# EasyEDA Pro project ProPrj_智能车主板第二版_2025-03-14.epro

# Schematic Schematic1
Board Name: Board1; Create Date: 2025-02-16; Page Name: P1; Project Name: 智能车主板; Schematic Name: Schematic1; Update Date: 2025-03-13; Company: 嘉立创EDA; Page Size: A4; Version: V1.0
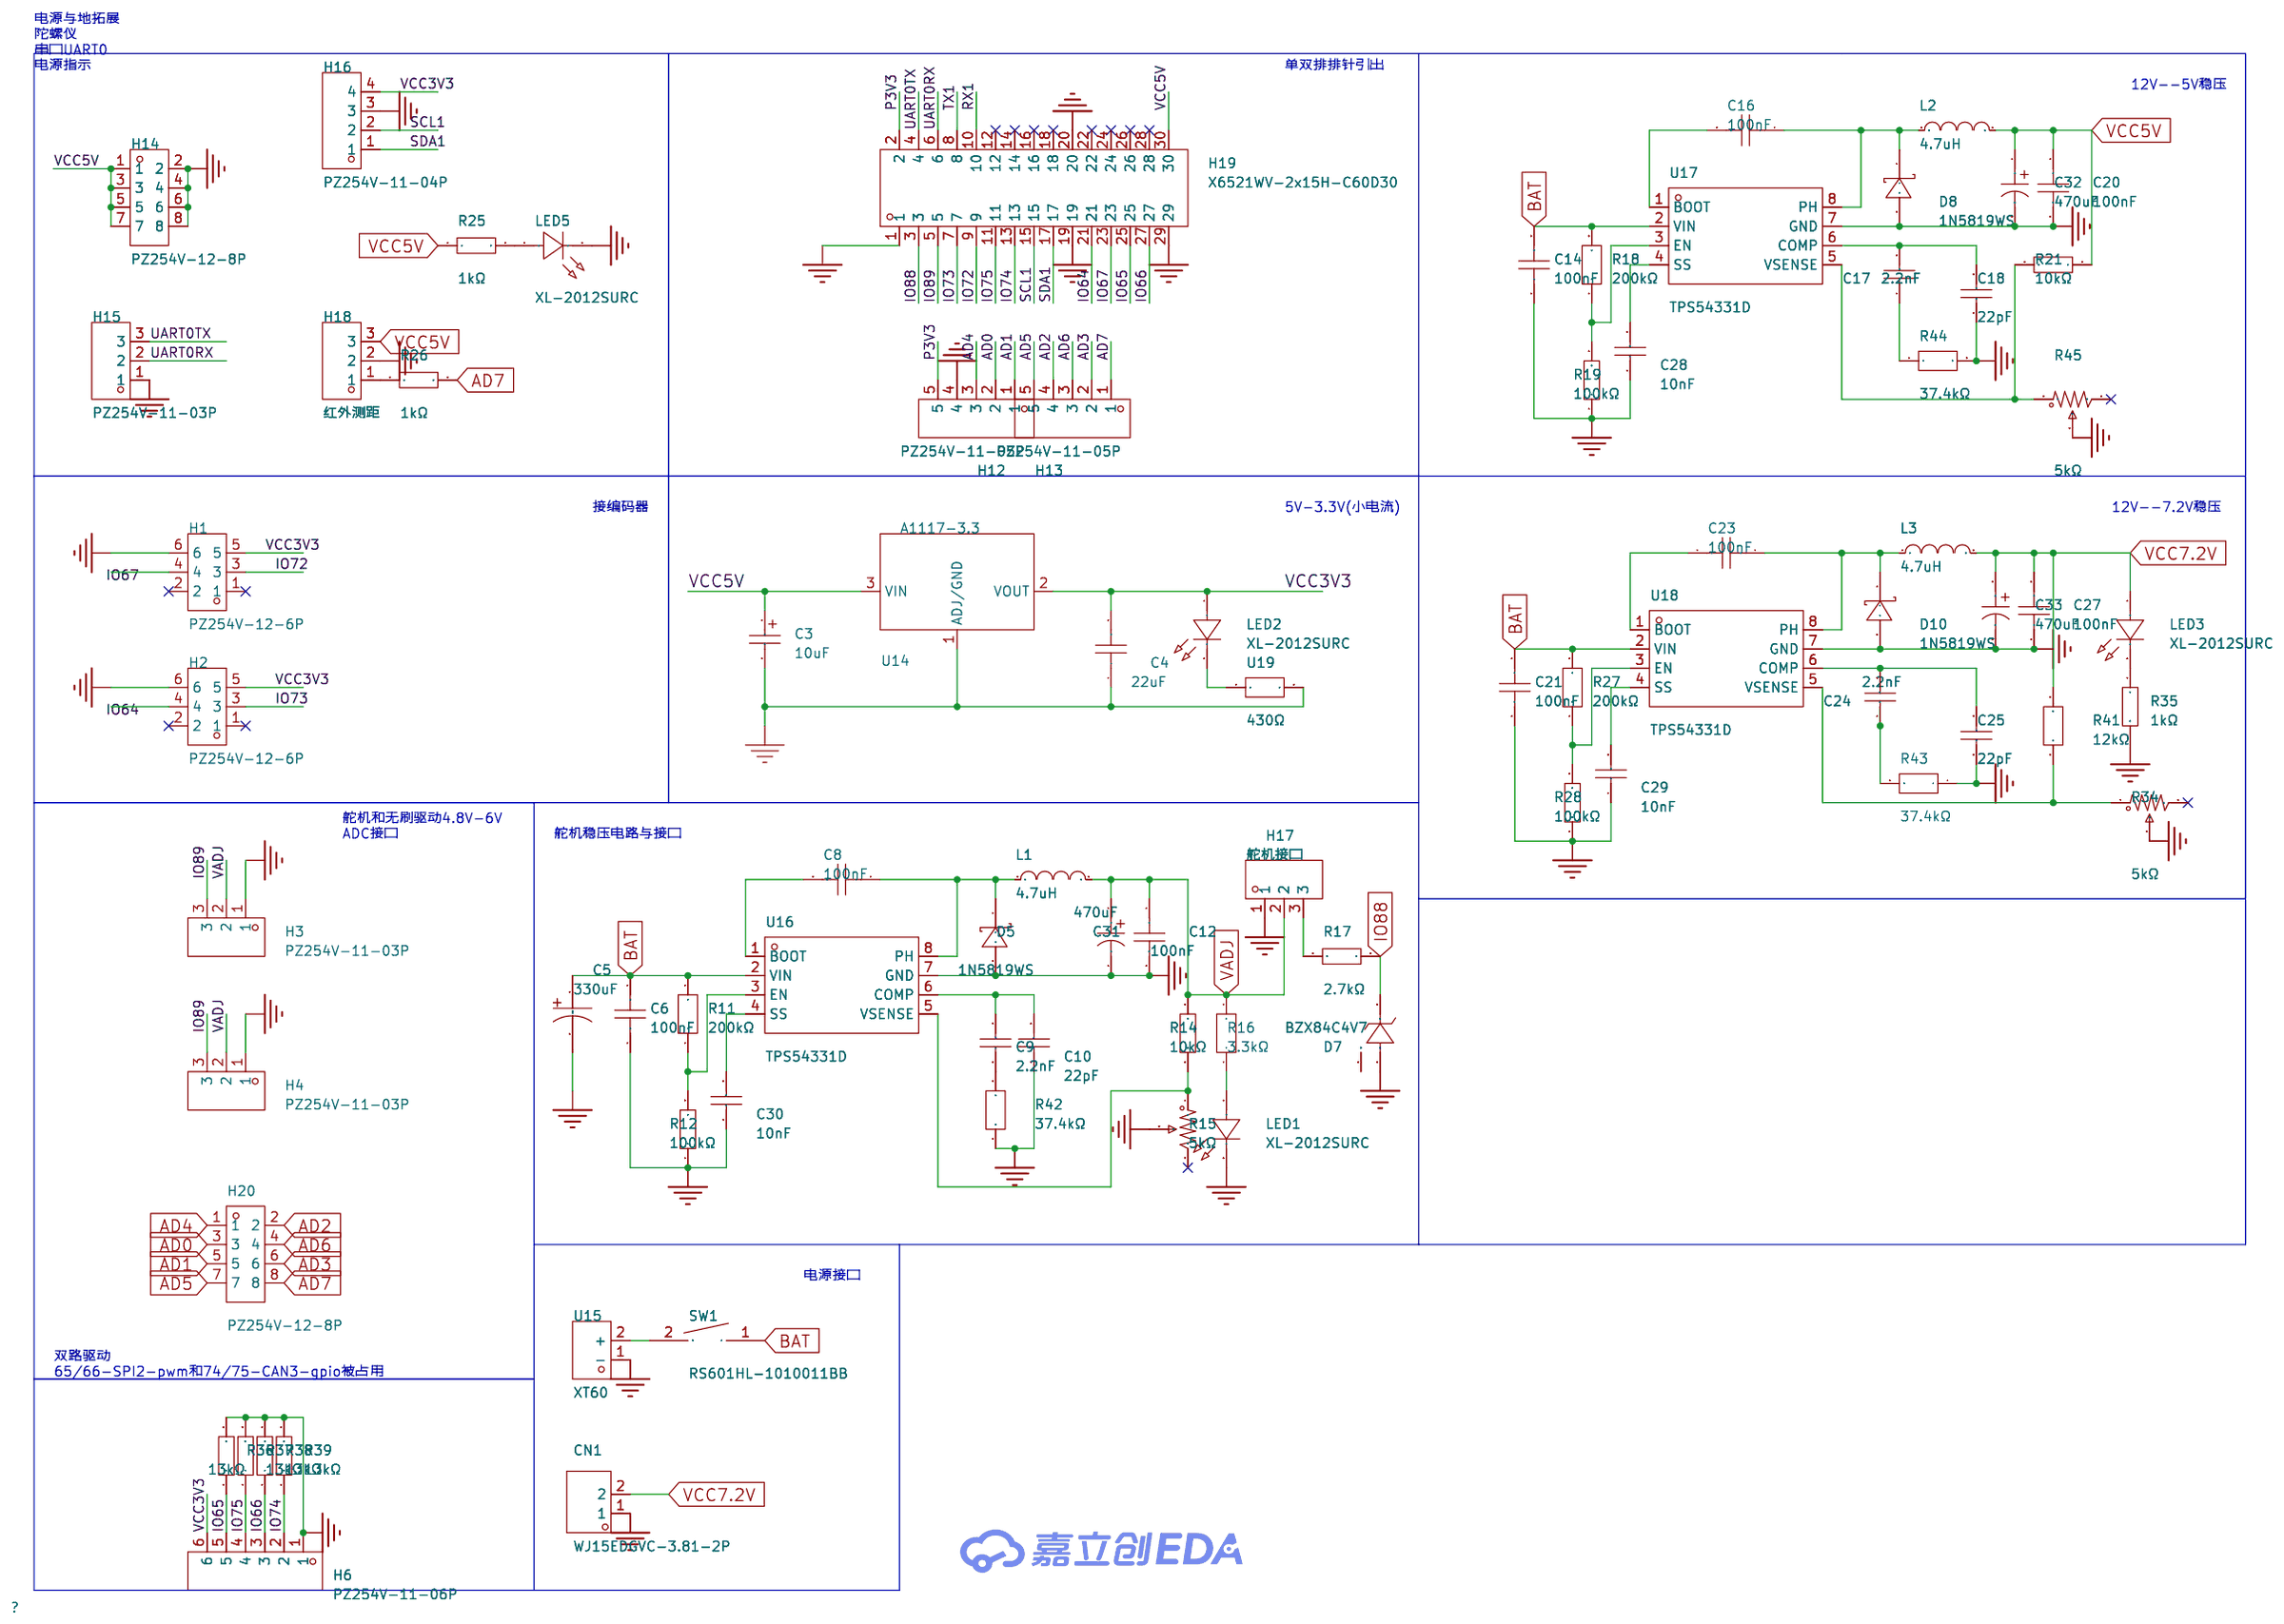
[diagram p0: schematic sheet]

## Parts
C3  10uF  [CAP-SMD_L6.0-W3.2]
C4  22uF  [C0805]
C5  330uF  [CAP-SMD_BD8.0-L8.3-W8.3-LS9.3-FD-1]
C6  100nF  [C0805]
C8  100nF  [C0805]
C9  2.2nF  [C0805]
C10  22pF  [C0603]
C12  100nF  [C0805]
C14  100nF  [C0805]
C16  100nF  [C0805]
C17  2.2nF  [C0805]
C18  22pF  [C0603]
C20  100nF  [C0805]
C21  100nF  [C0805]
C23  100nF  [C0805]
C24  2.2nF  [C0805]
C25  22pF  [C0603]
C27  100nF  [C0805]
C28  10nF  [C0805]
C29  10nF  [C0805]
C30  10nF  [C0805]
C31  470uF  [CAP-SMD_BD8.0-L8.3-W8.3-LS8.9-FD]
C32  470uF  [CAP-SMD_BD8.0-L8.3-W8.3-LS8.9-FD]
C33  470uF  [CAP-SMD_BD8.0-L8.3-W8.3-LS8.9-FD]
CN1  WJ15EDGVC-3.81-2P  [CONN-TH_WJ15EDGVC-3.81-2P]
D5  1N5819WS  [SOD-323_L1.8-W1.3-LS2.5-RD]
D7  BZX84C4V7  [SOT-23-3_L2.9-W1.3-P1.90-LS2.4-BR]
D8  1N5819WS  [SOD-323_L1.8-W1.3-LS2.5-RD]
D10  1N5819WS  [SOD-323_L1.8-W1.3-LS2.5-RD]
H1  PZ254V-12-6P  [HDR-TH_6P-P2.54-V-M-R2-C3-S2.54]
H2  PZ254V-12-6P  [HDR-TH_6P-P2.54-V-M-R2-C3-S2.54]
H3  PZ254V-11-03P  [HDR-TH_3P-P2.54-V-M]
H4  PZ254V-11-03P  [HDR-TH_3P-P2.54-V-M]
H6  PZ254V-11-06P  [HDR-TH_6P-P2.54-V-M]
H12  PZ254V-11-05P  [HDR-TH_5P-P2.54-V-M]
H13  PZ254V-11-05P  [HDR-TH_5P-P2.54-V-M]
H14  PZ254V-12-8P  [HDR-TH_8P-P2.54-V-M-R2-C4-S2.54]
H15  PZ254V-11-03P  [HDR-TH_3P-P2.54-V-M]
H16  PZ254V-11-04P  [HDR-TH_4P-P2.54-V-M]
H17  舵机接口  [HDR-TH_3P-P2.54-V-M]
H18  红外测距  [HDR-TH_3P-P2.54-V-M]
H19  X6521WV-2x15H-C60D30  [HDR-TH_30P-P2.54-V-M-R2-C15-S2.54-BL]
H20  PZ254V-12-8P  [HDR-TH_8P-P2.54-V-M-R2-C4-S2.54]
L1  4.7uH  [IND-SMD_L7.3-W6.6_MHCI06030]
L2  4.7uH  [IND-SMD_L7.3-W6.6_MHCI06030]
L3  4.7uH  [IND-SMD_L7.3-W6.6_MHCI06030]
LED1  XL-2012SURC  [LED0805-R-RD]
LED2  XL-2012SURC  [LED0805-R-RD]
LED3  XL-2012SURC  [LED0805-R-RD]
LED5  XL-2012SURC  [LED0805-R-RD]
R11  200kΩ  [R0603]
R12  100kΩ  [R0805]
R14  10kΩ  [R0805]
R15  5kΩ  [RES-ADJ-TH_3P-L6.8-W4.6-P2.50-TL-BS-3266X]
R16  3.3kΩ  [R0805]
R17  2.7kΩ  [R0603]
R18  200kΩ  [R0603]
R19  100kΩ  [R0805]
R21  10kΩ  [R0805]
R25  1kΩ  [R0603]
R26  1kΩ  [R0603]
R27  200kΩ  [R0603]
R28  100kΩ  [R0805]
R34  5kΩ  [RES-ADJ-TH_3P-L6.8-W4.6-P2.50-TL-BS-3266X]
R35  1kΩ  [R0603]
R36  13kΩ  [R0805]
R37  13kΩ  [R0805]
R38  13kΩ  [R0805]
R39  13kΩ  [R0805]
R41  12kΩ  [R0805]
R42  37.4kΩ  [R0603]
R43  37.4kΩ  [R0603]
R44  37.4kΩ  [R0603]
R45  5kΩ  [RES-ADJ-TH_3P-L6.8-W4.6-P2.50-TL-BS-3266X]
SW1  RS601HL-1010011BB  [SW-TH_RS601HL-1010011BB]
U14  A1117-3.3  [asm1117]
U15  XT60  [CONN-TH_XT60]
U16  TPS54331D  [SOIC-8_L4.9-W3.9-P1.27-LS6.0-BL]
U17  TPS54331D  [SOIC-8_L4.9-W3.9-P1.27-LS6.0-BL]
U18  TPS54331D  [SOIC-8_L4.9-W3.9-P1.27-LS6.0-BL]
U19  430Ω  [R0805]

## Library data of the parts
C3 = TAJC106K016RNJ: 容值:10uF;精度:±10%;额定电压:16V;等效串联电阻:2Ω@100kHz;; LCSC Part Name: 10uF ±10% 16V; Supplier Part: C7209; Manufacturer: Kyocera AVX; Supplier Footprint: CASE-C-6032; JLCPCB Part Class: 扩展库; Datasheet: https://atta.szlcsc.com/upload/public/pdf/source/20160107/1457707750344.pdf; Supplier: LCSC; Tolerance: ±10%; Rated Voltage: 16V; Equivalent Series Resistance(ESR): 2Ω@100kHz; Operating Temperature: -55℃~+125℃
C4 = CGA0805X5R226M350MT: 容值:22uF;精度:±20%;额定电压:35V;材质(温度系数):X5R;; LCSC Part Name: 22uF ±20% 35V; Supplier Part: C6119901; Manufacturer: HRE(芯声); Supplier Footprint: 0805; JLCPCB Part Class: 扩展库; Datasheet: https://atta.szlcsc.com/upload/public/pdf/source/20231129/D589D0CC4D260F7AC3A77E53B455CCB3.pdf; Supplier: LCSC; Tolerance: ±20%; Voltage Rated: 35V; Temperature Coefficient: X5R
C5 = RVT1E331M0810_C335985: 容值:330uF;精度:±20%;额定电压:25V;纹波电流:228mA@120Hz;等效串联电阻(ESR):-;; LCSC Part Name: 330uF ±20% 25V; Supplier Part: C335985; Manufacturer: ROQANG(容强); Manufacturer Part: RVT1E331M0810; Supplier Footprint: SMD,D8xL10.2mm; JLCPCB Part Class: Extended Part; Datasheet: https://atta.szlcsc.com/upload/public/pdf/source/20181128/C335987_23CA7AA50FB42690DF736C43FE112376.pdf; Supplier: LCSC; Tolerance: ±20%; Voltage Rating: 25V; Ripple Current: 228mA@120Hz; Diameter: 8mm; Height - Seated (Max): 10.2mm; Lifetime: 2000hrs@105℃; Operating Temperature: -40℃~+105℃
C6 C8 C12 C14 C16 C20 C21 C23 C27 = CC0805KRX7R9BB104: 容值:100nF;精度:±10%;额定电压:50V;材质(温度系数):X7R;; LCSC Part Name: 100nF ±10% 50V; Supplier Part: C49678; Manufacturer: YAGEO(国巨); Supplier Footprint: 0805; JLCPCB Part Class: 基础库; Datasheet: https://atta.szlcsc.com/upload/public/pdf/source/20180224/C181747_15194369449651363981.pdf; Supplier: LCSC; Tolerance: ±10%; Voltage Rated: 50V; Temperature Coefficient: X7R
C9 C17 C24 = CL21C222JBFNNNE: 容值:2.2nF;精度:±5%;额定电压:50V;材质(温度系数):C0G;; LCSC Part Name: 2.2nF ±5% 50V; Supplier Part: C28260; Manufacturer: SAMSUNG(三星); Supplier Footprint: 0805; JLCPCB Part Class: 基础库; Datasheet: https://atta.szlcsc.com/upload/public/pdf/source/20160218/1457707763339.pdf; Supplier: LCSC; Tolerance: ±5%; Voltage Rated: 50V; Temperature Coefficient: C0G
C10 C18 C25 = CC0603JRNPO9BN220: 容值:22pF;精度:±5%;额定电压:50V;材质(温度系数):NP0;; LCSC Part Name: 22pF ±5% 50V; Supplier Part: C105620; Manufacturer: YAGEO(国巨); Supplier Footprint: 0603; JLCPCB Part Class: 扩展库; Datasheet: https://atta.szlcsc.com/upload/public/pdf/source/20170505/1493957838062.pdf; Supplier: LCSC; Tolerance: ±5%; Voltage Rated: 50V; Temperature Coefficient: NP0
C28-C30 = CL21B103KBANNNC: 容值:10nF;精度:±10%;额定电压:50V;材质(温度系数):X7R;; LCSC Part Name: 10nF ±10% 50V; Supplier Part: C1710; Manufacturer: SAMSUNG(三星); Supplier Footprint: 0805; JLCPCB Part Class: 基础库; Datasheet: https://atta.szlcsc.com/upload/public/pdf/source/20160218/1457707763339.pdf; Supplier: LCSC; Tolerance: ±10%; Voltage Rated: 50V; Temperature Coefficient: X7R
C31-C33 = CK1C471M-CRF10_C5162359: 容值:470uF;精度:±20%;额定电压:16V;纹波电流:240mA@120Hz;; LCSC Part Name: 470uF ±20% 16V; Supplier Part: C5162359; Manufacturer: ROQANG(容强); Manufacturer Part: CK1C471M-CRF10; Supplier Footprint: SMD,D8xL10.5mm; JLCPCB Part Class: Extended Part; Datasheet: https://atta.szlcsc.com/upload/public/pdf/source/20220915/8032839608EC75446813685B95DE3107.pdf; Supplier: LCSC; Tolerance: ±20%; Voltage Rating: 16V; Ripple Current: 240mA@120Hz; Diameter: 8mm; Height - Seated (Max): 10.5mm; Lifetime: 2000hrs@105℃; Operating Temperature: -40℃~+105℃
CN1 = WJ15EDGVC-3.81-2P: 连接器类型:板端/插座-闭口;固定方式:-;结构:1x2P;间距:3.81mm;颜色:-;安装方式:直针;排数:1;每排PIN数:2;额定电流:8A;额定电压:300V;线规 - AWG:-;线规 - 平方毫米:-;触头材质:黄铜;触头镀层:锡;工作温度范围:-40℃~+105℃;焊接温度(最大值):-;; LCSC Part Name: 1x2P 3.81mm 排数:1 每排P数:2; Supplier Part: C8396; Manufacturer: KANGNEX(康奈克斯电气); Supplier Footprint: 插件,P=3.81mm; JLCPCB Part Class: 扩展库; Datasheet: https://atta.szlcsc.com/upload/public/pdf/source/20191225/C8396_DFFE6D58C2AF45781C2AF0BF2B733CCC.pdf; Supplier: LCSC; Connector Type: 板端/插座-闭口; Structure: 1x2P; Pitch: 3.81mm; Mounting Style: 直针; Number of Pins: 2P; Number of Rows: 1; Number of PINs Per Row: 2; Current Rating (Max): 8A; Voltage Rating (Max): 300V; Contact Material: 黄铜; Contact Plating: 锡; Operating Temperature Range: -40℃~+105℃
D5 D8 D10 = 1N5819WS_C191023: 正向压降(Vf):600mV@1A;直流反向耐压(Vr):40V;整流电流:1A;; LCSC Part Name: 电压:40V 电流:1A; Supplier Part: C191023; Manufacturer: Hottech(合科泰); Supplier Footprint: SOD-323; JLCPCB Part Class: 基础库; Datasheet: https://atta.szlcsc.com/upload/public/pdf/source/20220428/3CB86FD8D28D653594B4E35F9D5AEFD9.pdf; Supplier: LCSC; Forward Voltage (Vf@If): 600mV@1A; Reverse Voltage (Vr): 40V; Rectified Current: 1A
D7 = BZX84C4V7_C841158: 二极管配置:独立式;稳压值(标称值):4.7V;稳压值(范围):4.4V~5V;耗散功率(Pd):350mW;; LCSC Part Name: 丝印Z1 BZX84C4V7; Supplier Part: C841158; Manufacturer: LGE(鲁光); Supplier Footprint: SOT-23; JLCPCB Part Class: 扩展库; Datasheet: https://atta.szlcsc.com/upload/public/pdf/source/20200521/C545312_81C845D7ABF6A946CB07E989BC227756.pdf; Supplier: LCSC; Diode Configuration: 独立式; Zener Voltage(Nom): 4.7V; Reverse Leakage Current (Ir): 3uA@2V; Zener Voltage(Range): 4.4V~5V; Pd - Power Dissipation: 350mW; Impedance(Zzt): 80Ω
H1 H2 = PZ254V-12-6P: 插针结构:2x3P;间距:2.54mm;行距:2.54mm;圆针/方针:方针;安装类型:直插;排数:双排;总PIN位数:6P;额定电流:-;额定电压:-;配合针长度:6mm;塑高:2.5mm;端接针长度:3mm;触头材质:黄铜;触头镀层:-;工作温度范围:-40℃~+105℃;颜色:黑色;; LCSC Part Name: 间距:2.54mm 2x3P 直插 方针; Supplier Part: C492420; Manufacturer: XFCN(兴飞); Supplier Footprint: 插件,P=2.54mm; JLCPCB Part Class: 扩展库; Datasheet: https://atta.szlcsc.com/upload/public/pdf/source/20200309/C492420_BAECB307B001054C09D200388220EAE6.pdf; Supplier: LCSC; Pin Structure: 2x3P; Pitch: 2.54mm; Row Spacing: 2.54mm; Circluar Pins/Square Pins: 方针; Mounting Type: 直插; Number of Rows: 双排; Number of Pins: 6P; Length of Mating Pin: 6mm; Insulation Height: 2.5mm; Length of End Connection Pin: 3mm; Contact Material: 黄铜; Operating Temperature Range: -40℃~+105℃; Color: 黑色
H3 H4 H15 H17 H18 = PZ254V-11-03P: 插针结构:1x3P;间距:2.54mm;行距:-;圆针/方针:方针;安装类型:直插;排数:单排;总PIN位数:3P;额定电流:3A;额定电压:250V;配合针长度:6mm;塑高:2.5mm;端接针长度:3mm;工作温度范围:-40℃~+105℃;颜色:黑色;; LCSC Part Name: 间距:2.54mm 1x3P 直插 方针; Supplier Part: C2937625; Manufacturer: XFCN(兴飞); Supplier Footprint: 插件,P=2.54mm; JLCPCB Part Class: 扩展库; Datasheet: https://atta.szlcsc.com/upload/public/pdf/source/20200309/C492402_8335C3D49C4E4C618838D59BB1D024C1.pdf; Supplier: LCSC; Pin Structure: 1x3P; Pitch: 2.54mm; Circluar Pins/Square Pins: 方针; Mounting Type: 直插; Number of Rows: 单排; Number of Pins: 3P; Current Rating (Max): 3A; Voltage Rating (Max): 250V; Length of Mating Pin: 6mm; Insulation Height: 2.5mm; Length of End Connection Pin: 3mm; Operating Temperature Range: -40℃~+105℃; Color: 黑色
H6 = PZ254V-11-06P: 插针结构:1x6P;间距:2.54mm;行距:-;圆针/方针:方针;安装类型:直插;排数:单排;总PIN位数:6P;额定电流:-;额定电压:-;配合针长度:6mm;塑高:2.5mm;端接针长度:3mm;触头材质:黄铜;触头镀层:-;工作温度范围:-40℃~+105℃;颜色:黑色;; LCSC Part Name: 间距:2.54mm 1x6P 直插 方针; Supplier Part: C492405; Manufacturer: XFCN(兴飞); Supplier Footprint: 插件,P=2.54mm; JLCPCB Part Class: 扩展库; Datasheet: https://atta.szlcsc.com/upload/public/pdf/source/20200309/C492405_597F1930F5B55CC3C7FD95458F1C3977.pdf; Supplier: LCSC; Pin Structure: 1x6P; Pitch: 2.54mm; Circluar Pins/Square Pins: 方针; Mounting Type: 直插; Number of Rows: 单排; Number of Pins: 6P; Length of Mating Pin: 6mm; Insulation Height: 2.5mm; Length of End Connection Pin: 3mm; Contact Material: 黄铜; Operating Temperature Range: -40℃~+105℃; Color: 黑色
H12 H13 = PZ254V-11-05P: 插针结构:1x5P;间距:2.54mm;行距:-;圆针/方针:方针;安装类型:直插;排数:单排;总PIN位数:5P;额定电流:-;额定电压:-;配合针长度:6mm;塑高:2.5mm;端接针长度:3mm;触头材质:黄铜;触头镀层:-;工作温度范围:-40℃~+105℃;颜色:黑色;; LCSC Part Name: 间距:2.54mm 1x5P 直插 方针; Supplier Part: C492404; Manufacturer: XFCN(兴飞); Supplier Footprint: 插件,P=2.54mm; JLCPCB Part Class: 扩展库; Datasheet: https://atta.szlcsc.com/upload/public/pdf/source/20200309/C492404_E51533260F8710EFF5D4617281164C1D.pdf; Supplier: LCSC; Pin Structure: 1x5P; Pitch: 2.54mm; Circluar Pins/Square Pins: 方针; Mounting Type: 直插; Number of Rows: 单排; Number of Pins: 5P; Length of Mating Pin: 6mm; Insulation Height: 2.5mm; Length of End Connection Pin: 3mm; Contact Material: 黄铜; Operating Temperature Range: -40℃~+105℃; Color: 黑色
H14 H20 = PZ254V-12-8P: 插针结构:2x4P;间距:2.54mm;行距:2.54mm;圆针/方针:方针;安装类型:直插;排数:双排;总PIN位数:8P;额定电流:-;额定电压:-;配合针长度:6mm;塑高:2.5mm;端接针长度:3mm;触头材质:黄铜;触头镀层:-;工作温度范围:-40℃~+105℃;颜色:黑色;; LCSC Part Name: 间距:2.54mm 2x4P 直插 方针; Supplier Part: C492421; Manufacturer: XFCN(兴飞); Supplier Footprint: 插件,P=2.54mm; JLCPCB Part Class: 扩展库; Datasheet: https://atta.szlcsc.com/upload/public/pdf/source/20200309/C492421_DC8A206AF99CD7755BD4A5B0BC48200B.pdf; Supplier: LCSC; Pin Structure: 2x4P; Pitch: 2.54mm; Row Spacing: 2.54mm; Circluar Pins/Square Pins: 方针; Mounting Type: 直插; Number of Rows: 双排; Number of Pins: 8P; Length of Mating Pin: 6mm; Insulation Height: 2.5mm; Length of End Connection Pin: 3mm; Contact Material: 黄铜; Operating Temperature Range: -40℃~+105℃; Color: 黑色
H16 = PZ254V-11-04P: 插针结构:1x4P;间距:2.54mm;行距:-;圆针/方针:方针;安装类型:直插;排数:单排;总PIN位数:4P;额定电流:3A;额定电压:250V;配合针长度:6mm;塑高:2.5mm;端接针长度:3mm;触头材质:-;工作温度范围:-40℃~+105℃;颜色:黑色;; LCSC Part Name: 间距:2.54mm 1x4P 直插 方针; Supplier Part: C2691448; Manufacturer: XFCN(兴飞); Supplier Footprint: 插件,P=2.54mm; JLCPCB Part Class: 扩展库; Datasheet: https://atta.szlcsc.com/upload/public/pdf/source/20200309/C492403_F9F19131791D08044AD4F84F8E751A34.pdf; Supplier: LCSC; Pin Structure: 1x4P; Pitch: 2.54mm; Circluar Pins/Square Pins: 方针; Mounting Type: 直插; Number of Rows: 单排; Number of Pins: 4P; Current Rating (Max): 3A; Voltage Rating (Max): 250V; Length of Mating Pin: 6mm; Insulation Height: 2.5mm; Length of End Connection Pin: 3mm; Operating Temperature Range: -40℃~+105℃; Color: 黑色
H19 = X6521WV-2x15H-C60D30: 插针结构:2x15P;间距:2.54mm;行距:2.54mm;圆针/方针:方针;安装类型:-;排数:双排;总PIN位数:30P;额定电流:3A;额定电压:250V;配合针长度:-;塑高:2.5mm;端接针长度:-;触头材质:黄铜;触头镀层:金;工作温度范围:-40℃~+105℃;焊接温度(最大值):260℃;颜色:黑色;; LCSC Part Name: 2x15P 间距:2.54mm 方针; Supplier Part: C725887; Manufacturer: XKB Connection(中国星坤); Supplier Footprint: 插件,P=2.54mm; JLCPCB Part Class: 扩展库; Datasheet: https://atta.szlcsc.com/upload/public/pdf/source/20230814/F1C4971E164A170E66FC7330ABFF6881.pdf; Supplier: LCSC; Pin Structure: 2x15P; Pitch: 2.54mm; Row Spacing: 2.54mm; Circluar Pins/Square Pins: 方针; Number of Rows: 双排; Number of Pins: 30P; Current Rating (Max): 3A; Voltage Rating (Max): 250V; Insulation Height: 2.5mm; Contact Material: 黄铜; Contact Plating: 金; Operating Temperature Range: -40℃~+105℃; Soldering Temperature(Max): 260℃; Color: 黑色
L1-L3 = SLO0630H4R7MTT: 电感值:4.7uH;精度:±20%;额定电流:5.5A;; LCSC Part Name: 4.7uH ±20%; Supplier Part: C207840; Manufacturer: Sunltech(韩国顺磁); Supplier Footprint: SMD,6.6x7.1mm; JLCPCB Part Class: 扩展库; Datasheet: https://atta.szlcsc.com/upload/public/pdf/source/20190925/C207844_D5F1113EB7E791F3C24FBC0C5D2BA774.pdf; Supplier: LCSC; Tolerance: ±20%; Rated Current: 5.5A; DC Resistance (DCR): 38mΩ
LED1-LED3 LED5 = XL-2012SURC: 发光颜色:红色;功率:55mW;正向电流:25mA;主波长:617nm~621nm;透镜颜色:无色透明透镜;色温:-;发光角度:120°;载带方式:正贴;工作温度:-30℃~+85℃;; Supplier Part: C965812; Manufacturer: XINGLIGHT(成兴光); Supplier Footprint: 0805; JLCPCB Part Class: 扩展库; Datasheet: https://atta.szlcsc.com/upload/public/pdf/source/20221102/49E1A0A365644091E6270AF1C5E0FE37.pdf; Supplier: LCSC; Emitted Color: 红色; Power Dissipation: 55mW; Forward Current: 25mA; Dominant Wavelength: 617nm~621nm; Peak Wavelength: 623nm; Lens Color: 无色透明透镜; Viewing Angle: 120°; Mounting Sytle: 正贴; Operating Temperature: -30℃~+85℃
R11 R18 R27 = FRC0603F2003TS: 电阻类型:厚膜电阻;阻值:200kΩ;精度:±1%;功率:100mW;工作电压:75V;温度系数:±100ppm/℃;; LCSC Part Name: 200kΩ ±1% 100mW 厚膜电阻; Supplier Part: C2907009; Manufacturer: FOJAN(富捷); Supplier Footprint: 0603; JLCPCB Part Class: 扩展库; Datasheet: https://atta.szlcsc.com/upload/public/pdf/source/20211221/925EC7D7225764EE0046F22065062C87.pdf; Supplier: LCSC; Type: 厚膜电阻; Tolerance: ±1%; Power(Watts): 100mW; Voltage-Supply(Max): 75V; Temperature Coefficient: ±100ppm/℃; Operating Temperature: -55℃~+155℃
R12 R19 R28 = 0805W8F1003T5E: 电阻类型:厚膜电阻;阻值:100kΩ;精度:±1%;功率:125mW;最大工作电压:150V;温度系数:±100ppm/℃;; LCSC Part Name: 100kΩ ±1% 125mW 厚膜电阻; Supplier Part: C149504; Manufacturer: UNI-ROYAL(厚声); Supplier Footprint: 0805; JLCPCB Part Class: 基础库; Datasheet: https://atta.szlcsc.com/upload/public/pdf/source/20200306/C422600_1E6D84923E4A46A82E41ADD87F860B5C.pdf; Supplier: LCSC; Type: 厚膜电阻; Tolerance: ±1%; Power(Watts): 125mW; Overload Voltage (Max): 150V; Temperature Coefficient: ±100ppm/℃; Operating Temperature Range: -55℃~+155℃
R14 R21 = 0805W8F1002T5E_C17414: 电阻类型:厚膜电阻;阻值:10kΩ;精度:±1%;功率:125mW;最大工作电压:150V;温度系数:±100ppm/℃;; LCSC Part Name: 10kΩ ±1% 125mW 厚膜电阻; Supplier Part: C17414; Manufacturer: UNI-ROYAL(厚声); Manufacturer Part: 0805W8F1002T5E; Supplier Footprint: 0805; JLCPCB Part Class: 基础库; Datasheet: https://atta.szlcsc.com/upload/public/pdf/source/20200306/C422600_1E6D84923E4A46A82E41ADD87F860B5C.pdf; Supplier: LCSC; Type: 厚膜电阻; Tolerance: ±1%; Power(Watts): 125mW; Overload Voltage (Max): 150V; Temperature Coefficient: ±100ppm/℃; Operating Temperature Range: -55℃~+155℃
R15 R34 R45 = 3266X-1-502LF: 阻值:5kΩ;精度:±10%;功率:250mW;温度系数:±100ppm/℃;; LCSC Part Name: 5kΩ ±10%; Supplier Part: C780223; Manufacturer: BOURNS; Supplier Footprint: 插件-3P,6.4x4.3mm; JLCPCB Part Class: 扩展库; Datasheet: https://atta.szlcsc.com/upload/public/pdf/source/20200907/C462144_DF8D44480140B6FE24360552451E91FC.pdf; Supplier: LCSC; Tolerance: ±10%; Power(Watts): 250mW; Temperature Coefficient: ±100ppm/℃; Turns: 12
R16 = FRC0805F3301TS: 电阻类型:厚膜电阻;阻值:3.3kΩ;精度:±1%;功率:125mW;最大工作电压:150V;温度系数:±100ppm/℃;; LCSC Part Name: 3.3kΩ ±1% 125mW 厚膜电阻; Supplier Part: C2907249; Manufacturer: FOJAN(富捷); Supplier Footprint: 0805; JLCPCB Part Class: 扩展库; Datasheet: https://atta.szlcsc.com/upload/public/pdf/source/20211221/925EC7D7225764EE0046F22065062C87.pdf; Supplier: LCSC; Type: 厚膜电阻; Tolerance: ±1%; Power(Watts): 125mW; Overload Voltage (Max): 150V; Temperature Coefficient: ±100ppm/℃; Operating Temperature Range: -55℃~+155℃
R17 = 0603WAF2701T5E: 电阻类型:厚膜电阻;阻值:2.7kΩ;精度:±1%;功率:100mW;最大工作电压:75V;温度系数:±100ppm/℃;; LCSC Part Name: 2.7kΩ ±1% 100mW 厚膜电阻; Supplier Part: C13167; Manufacturer: UNI-ROYAL(厚声); Supplier Footprint: 0603; JLCPCB Part Class: 基础库; Datasheet: https://atta.szlcsc.com/upload/public/pdf/source/20200306/C422600_1E6D84923E4A46A82E41ADD87F860B5C.pdf; Supplier: LCSC; Type: 厚膜电阻; Tolerance: ±1%; Power(Watts): 100mW; Overload Voltage (Max): 75V; Temperature Coefficient: ±100ppm/℃; Operating Temperature Range: -55℃~+155℃
R25 R26 = 0603WAF1001T5E: 电阻类型:厚膜电阻;阻值:1kΩ;精度:±1%;功率:100mW;最大工作电压:75V;温度系数:±100ppm/℃;; LCSC Part Name: 1kΩ ±1% 100mW 厚膜电阻; Supplier Part: C21190; Manufacturer: UNI-ROYAL(厚声); Supplier Footprint: 0603; JLCPCB Part Class: 基础库; Datasheet: https://atta.szlcsc.com/upload/public/pdf/source/20200306/C422600_1E6D84923E4A46A82E41ADD87F860B5C.pdf; Supplier: LCSC; Type: 厚膜电阻; Tolerance: ±1%; Power(Watts): 100mW; Overload Voltage (Max): 75V; Temperature Coefficient: ±100ppm/℃; Operating Temperature Range: -55℃~+155℃
R35 = 0603WAF5100T5E: 电阻类型:厚膜电阻;阻值:510Ω;精度:±1%;功率:100mW;最大工作电压:75V;温度系数:±100ppm/℃;; LCSC Part Name: 510Ω ±1% 100mW 厚膜电阻; Supplier Part: C23193; Manufacturer: UNI-ROYAL(厚声); Supplier Footprint: 0603; JLCPCB Part Class: 基础库; Datasheet: https://atta.szlcsc.com/upload/public/pdf/source/20200306/C422600_1E6D84923E4A46A82E41ADD87F860B5C.pdf; Supplier: LCSC; Type: 厚膜电阻; Tolerance: ±1%; Power(Watts): 100mW; Overload Voltage (Max): 75V; Temperature Coefficient: ±100ppm/℃; Operating Temperature Range: -55℃~+155℃
R36-R39 = 0805W8F1302T5E: 电阻类型:厚膜电阻;阻值:13kΩ;精度:±1%;功率:125mW;最大工作电压:150V;温度系数:±100ppm/℃;; LCSC Part Name: 13kΩ ±1% 125mW 厚膜电阻; Supplier Part: C17455; Manufacturer: UNI-ROYAL(厚声); Supplier Footprint: 0805; JLCPCB Part Class: 扩展库; Datasheet: https://atta.szlcsc.com/upload/public/pdf/source/20200306/C422600_1E6D84923E4A46A82E41ADD87F860B5C.pdf; Supplier: LCSC; Type: 厚膜电阻; Tolerance: ±1%; Power(Watts): 125mW; Overload Voltage (Max): 150V; Temperature Coefficient: ±100ppm/℃; Operating Temperature Range: -55℃~+155℃
R41 = FRC0805F1202TS: 电阻类型:厚膜电阻;阻值:12kΩ;精度:±1%;功率:125mW;最大工作电压:150V;温度系数:±100ppm/℃;; LCSC Part Name: 12kΩ ±1% 125mW 厚膜电阻; Supplier Part: C2907225; Manufacturer: FOJAN(富捷); Supplier Footprint: 0805; JLCPCB Part Class: 扩展库; Datasheet: https://atta.szlcsc.com/upload/public/pdf/source/20211221/925EC7D7225764EE0046F22065062C87.pdf; Supplier: LCSC; Type: 厚膜电阻; Tolerance: ±1%; Power(Watts): 125mW; Overload Voltage (Max): 150V; Temperature Coefficient: ±100ppm/℃; Operating Temperature Range: -55℃~+155℃
R42-R44 = RN73R1JTTD3702C25: 电阻类型:薄膜电阻;阻值:37kΩ;精度:±0.25%;功率:100mW;最大工作电压:75V;温度系数:±25ppm/℃;; LCSC Part Name: 薄膜电阻 37kΩ ±0.25% 100mW; Supplier Part: C2517971; Manufacturer: KOA; Supplier Footprint: 0603; JLCPCB Part Class: 扩展库; Datasheet: https://atta.szlcsc.com/upload/public/pdf/source/20210531/098CC3F3FCFB64C44C5D5A5059E9C1A2.pdf; Supplier: LCSC; Type: 薄膜电阻; Tolerance: ±0.25%; Power(Watts): 100mW; Overload Voltage (Max): 75V; Temperature Coefficient: ±25ppm/℃; Operating Temperature Range: -55℃~+155℃
SW1 = RS601HL-1010011BB: 带灯:无;引脚样式:焊片;额定电流:3A;额定电压(AC):250V;额定电压(DC):-;电路结构:单刀单掷;机械寿命:1万次;; Supplier Part: C2885782; Manufacturer: HCTL(华灿天禄); Supplier Footprint: 插件; JLCPCB Part Class: 扩展库; Datasheet: https://atta.szlcsc.com/upload/public/pdf/source/20210820/B1970E40D09304D7FA648AE2099FB3E8.pdf; Supplier: LCSC; Switch Length: 15mm; Switch Width: 10.5mm; Switch Height: 11.7mm; Actuator Type: 凹面弯曲; With Lamp: 无; Pin Style: 焊片; Actuator Color: 黑色; Contact Current: 3A; Voltage Rating (AC): 250V; Circuit: 单刀单掷; Mechanical Life: 1万次; Operating Temperature: -25℃~+85℃; Actuator Identifier: - O
U14 = A1117-3.3: LCSC Part Name: AMS1117-3.3; Supplier Part: C7432020; Manufacturer: IDCHIP(英锐芯); Supplier Footprint: SOT-223; Datasheet: https://atta.szlcsc.com/upload/public/pdf/source/20230625/435FEEFA02C0FE449E7397A11F8448E0.pdf; Supplier: LCSC; link: https://atta.szlcsc.com/upload/public/pdf/source/20230625/435FEEFA02C0FE449E7397A11F8448E0.pdf; Library Name: 工训小车
U15 = XT60: 类别:-;类型1:-;; LCSC Part Name: AMASS(艾迈斯) XT60模型插头 3.5mm镀金香蕉头公头（电调端）XT60-M; Supplier Part: C98733; Manufacturer: AMASS(艾迈斯); JLCPCB Part Class: 扩展库; Datasheet: https://atta.szlcsc.com/upload/public/pdf/source/20170606/1496716524919.pdf; Supplier: LCSC; Brand: 艾迈斯; Type: 香蕉头; Colour: 黄色; InterfaceType: 公头; specifications: 3.5mm
U16-U18 = TPS54331D: 功能类型:降压型;输出类型:可调;输入电压:3.5V~28V;输出电压:-;输出电流:3A;; LCSC Part Name: 3A、28V 输入、直流/直流降压转换器; Supplier Part: C2872693; Manufacturer: TI(德州仪器); Supplier Footprint: SOIC-8; JLCPCB Part Class: 扩展库; Datasheet: https://www.ti.com/cn/lit/gpn/tps54331; Supplier: LCSC; Function: 降压型; Output Type: 可调; Input Voltage: 3.5V~28V; Output Current: 3A; Switching Frequency: 570kHz; Operating Temperature: -40℃~+150℃; Synchronous Rectification: 否; Number of Outputs: 1; Topology: 降压式; Quiescent Current (Iq): 1uA; Switch tube (built-in/external): 内置
U19 = FRC0805F4300TS: 电阻类型:厚膜电阻;阻值:430Ω;精度:±1%;功率:125mW;最大工作电压:150V;温度系数:±100ppm/℃;; LCSC Part Name: 430Ω ±1% 125mW 厚膜电阻; Supplier Part: C2907265; Manufacturer: FOJAN(富捷); Supplier Footprint: 0805; JLCPCB Part Class: 扩展库; Datasheet: https://atta.szlcsc.com/upload/public/pdf/source/20211221/925EC7D7225764EE0046F22065062C87.pdf; Supplier: LCSC; Type: 厚膜电阻; Tolerance: ±1%; Power(Watts): 125mW; Overload Voltage (Max): 150V; Temperature Coefficient: ±100ppm/℃; Operating Temperature Range: -55℃~+155℃

## Nets
GND: C3.2 C4.1 C5.2 C6.1 C10.1 C12.2 C14.1 C18.1 C20.2 C21.1 C25.1 C27.2 C28.1 C29.1 C30.1 C31.2 C32.2 C33.2 CN1.1 D5.2(A) D7.1(A) D8.2(A) D10.2(A) H1.6 H2.6 H3.1 H4.1 H6.1 H12.4 H14.2 H14.4 H14.6 H14.8 H15.1 H16.3 H17.1 H18.2 H19.1 H19.19 H19.20 H19.29 LED1.2(K) LED5.2(K) R12.1 R15.2 R19.1 R28.1 R34.2 R35.2 R36.2 R37.2 R38.2 R39.2 R42.1 R43.1 R44.2 R45.2 U14.1(ADJ/GND) U15.1(-) U16.7(GND) U17.7(GND) U18.7(GND) U19.2
P3V3: H12.5 H19.2
VCC3V3: C4.2 H1.5 H2.5 H6.6 H16.4 LED2.1(A) U14.2(VOUT)
VCC5V: C3.1 C20.1 C32.1 H14.1 H14.3 H14.5 H14.7 H18.3 H19.30 L2.2 R21.1 R25.1 U14.3(VIN)
VCC7.2V: C27.1 C33.1 CN1.2 L3.2 LED3.1(A) R41.2
AD0: H12.2 H20.3
AD1: H12.1 H20.5
AD2: H13.4 H20.2
AD3: H13.2 H20.6
AD4: H12.3 H20.1
AD5: H13.5 H20.7
AD6: H13.3 H20.4
AD7: H13.1 H20.8 R26.2
BAT: C5.1 C6.2 C14.2 C21.2 R11.2 R18.2 R27.2 SW1.1 U16.2(VIN) U17.2(VIN) U18.2(VIN)
IO64: H2.4 H19.21
IO65: H6.5 H19.25 R36.1
IO66: H6.3 H19.27 R38.1
IO67: H1.4 H19.23
IO72: H1.3 H19.9
IO73: H2.3 H19.7
IO74: H6.2 H19.13 R39.1
IO75: H6.4 H19.11 R37.1
IO88: D7.3(C) H19.3 R17.1
IO89: H3.3 H4.3 H19.5
RX1: H19.10
SCL1: H16.2 H19.15
SDA1: H16.1 H19.17
TX1: H19.8
UART0RX: H15.2 H19.6
UART0TX: H15.3 H19.4
VADJ: C12.1 C31.1 H3.2 H4.2 H17.2 L1.2 R14.2 R16.2
VSESE: R34.1 R41.1 U18.5(VSENSE)
$1N5106: LED2.2(K) U19.1
$1N8621: R11.1 R12.2 U16.3(EN)
$1N9019: C30.2 U16.4(SS)
$1N9100: C8.2 U16.1(BOOT)
$1N9333: C9.2 C10.2 U16.6(COMP)
$1N9888: R14.1 R15.1 U16.5(VSENSE)
$1N10078: C8.1 D5.1(K) L1.1 U16.8(PH)
$1N11574: R18.1 R19.2 U17.3(EN)
$1N11589: C28.2 U17.4(SS)
$1N11592: C16.2 U17.1(BOOT)
$1N11595: C17.1 R44.1
$1N11601: C17.2 C18.2 U17.6(COMP)
$1N11624: C16.1 D8.1(K) L2.1 U17.8(PH)
$1N11734: R21.2 R45.1 U17.5(VSENSE)
$1N14868: R27.1 R28.2 U18.3(EN)
$1N14871: C29.2 U18.4(SS)
$1N14872: C23.2 U18.1(BOOT)
$1N14873: C24.1 R43.2
$1N14875: C24.2 C25.2 U18.6(COMP)
$1N14877: C23.1 D10.1(K) L3.1 U18.8(PH)
$1N31767: C9.1 R42.2
$1N44983: LED5.1(A) R25.2
Net-(H17-3): H17.3 R17.2
Net-(H18-1): H18.1 R26.1
Net-(LED1-1): LED1.1(A) R16.1
Net-(LED3-2): LED3.2(K) R35.1
Net-(SW1-2): SW1.2 U15.2(+)

Not connected (* = marked no-connect by the designer): D7 2(NC); H1 1* 2*; H2 1* 2*; H19 12* 14* 16* 18* 22* 24* 26* 28*; R15 3*; R34 3*; R45 3*

## Notes on the sheet
- 电源与地拓展
  陀螺仪
  串口UART0
  电源指示
- 单双排排针引出
- 12V--5V稳压
- 接编码器
- 5V-3.3V(小电流)
- 12V--7.2V稳压
- 舵机和无刷驱动4.8V-6V
  ADC接口
- 舵机稳压电路与接口
- 电源接口
- 双路驱动
  65/66-SPI2-pwm和74/75-CAN3-gpio被占用

# Board PCB1
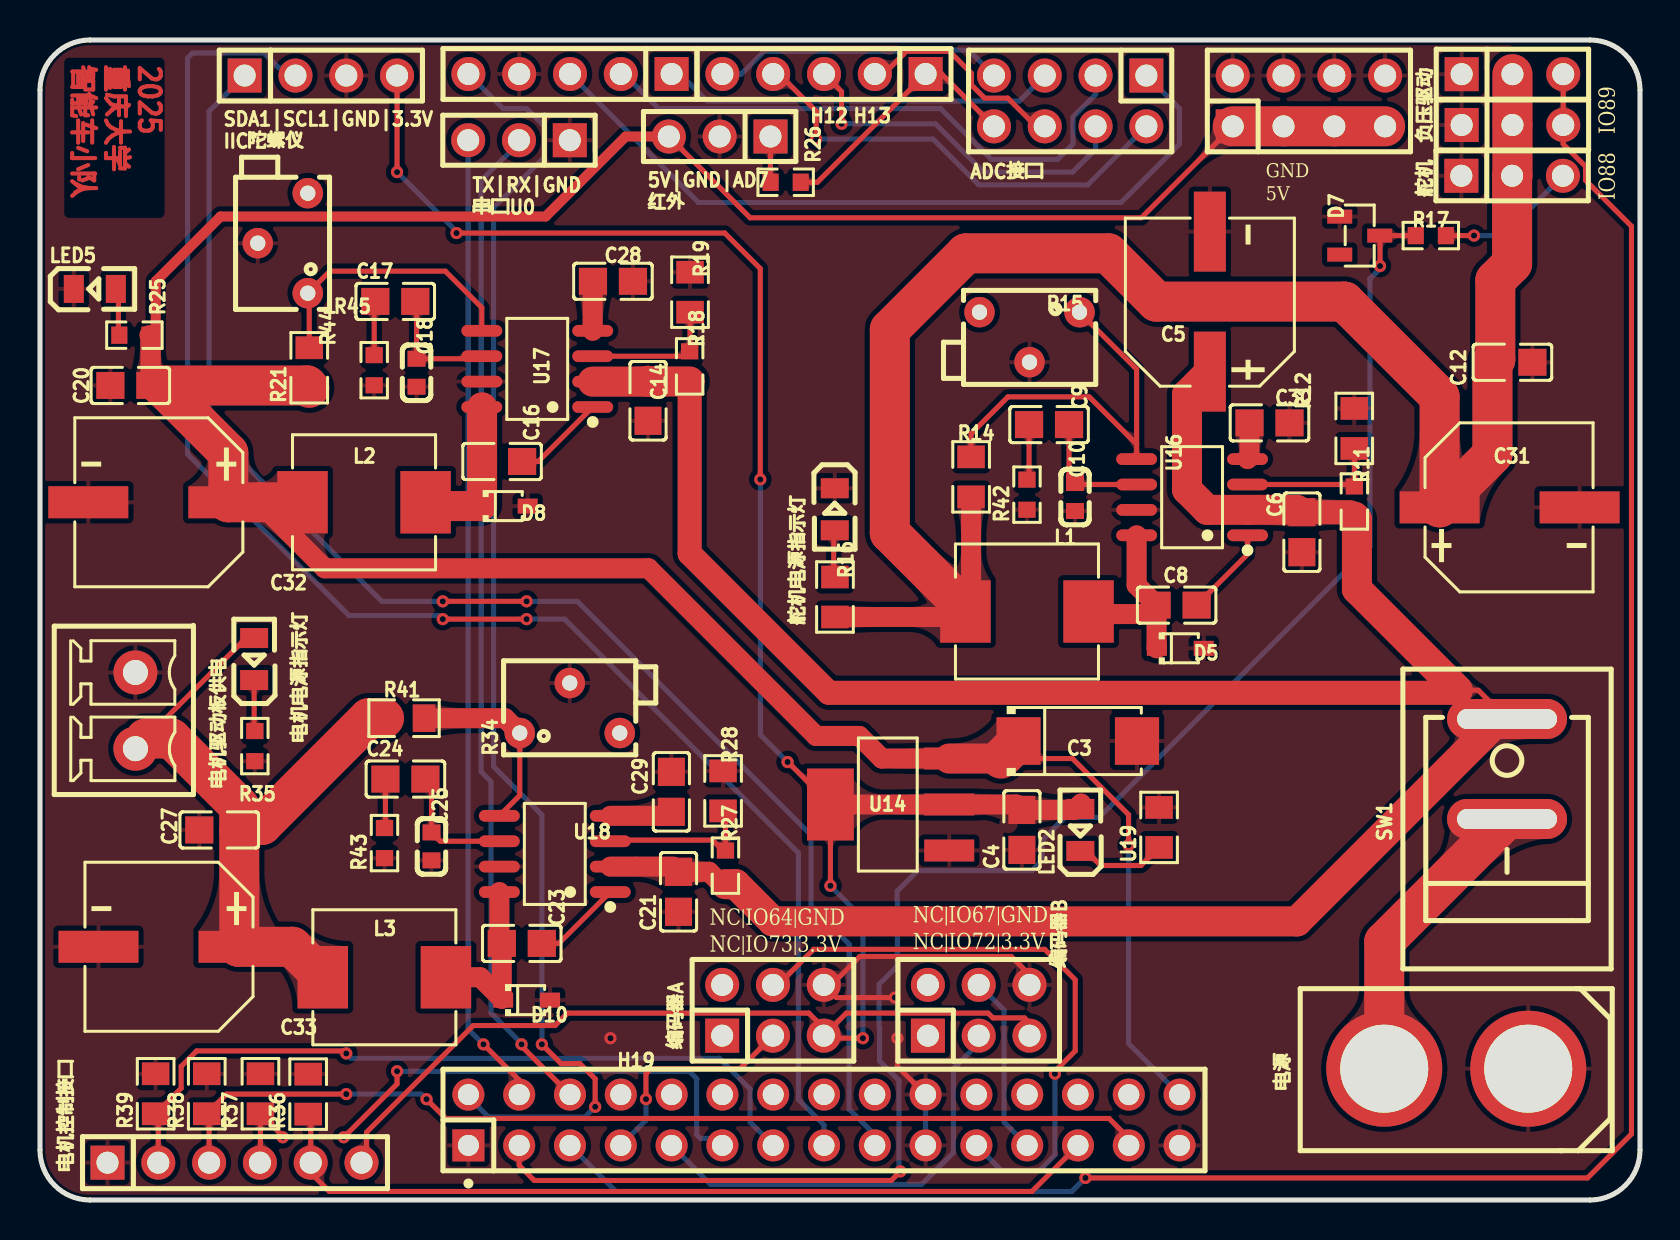
[diagram p1: board, top side]
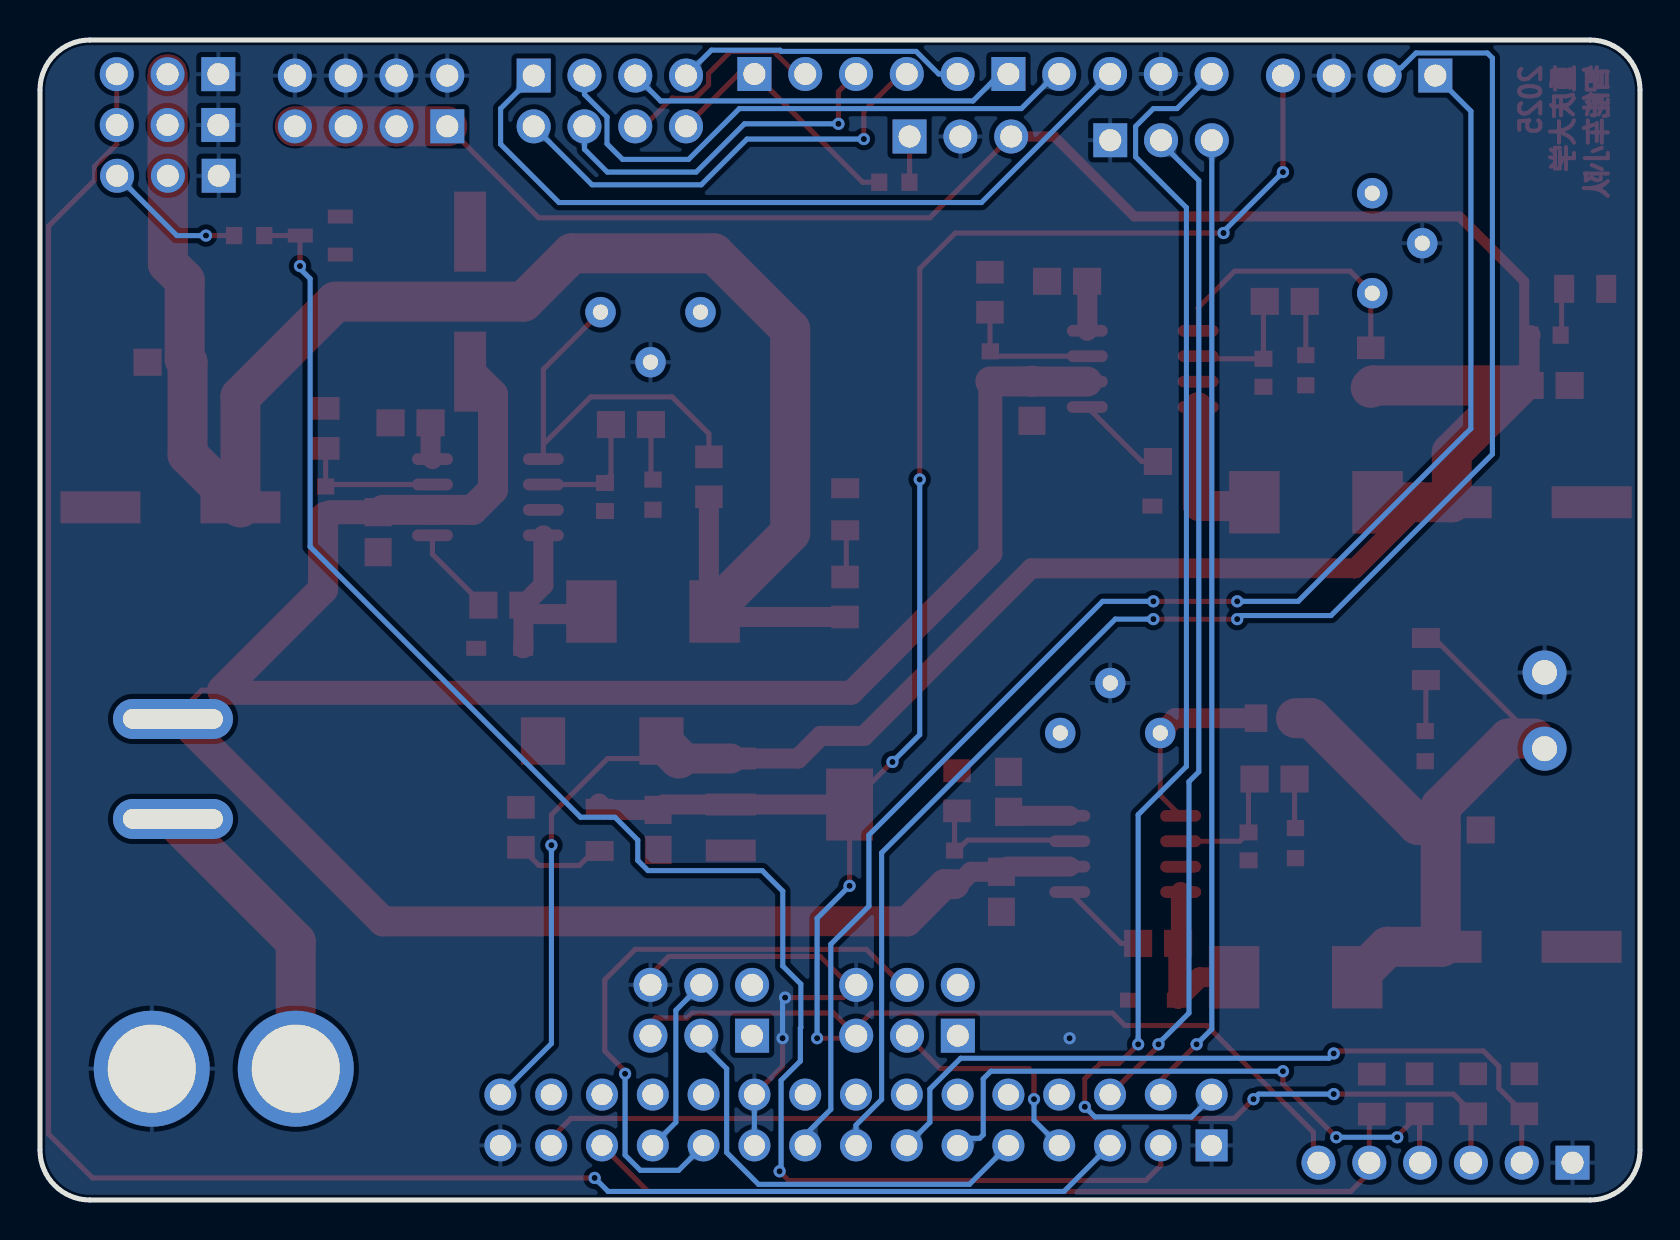
[diagram p2: board, bottom side, seen from below]

Outline 80 x 58 mm; copper layers: Top Layer, Bottom Layer. Coordinates in mm from the lower left corner of the outline.
Outline path: 0,55.5 0,2.5 arc(0.73,0.73) 2.5,0 77.5,0 arc(79.27,0.73) 80,2.5 80,55.5 arc(79.27,57.27) 77.5,58 2.5,58 arc(0.73,57.27) 0,55.5
Stack: Top Layer 0.035mm / Dielectric1 1.51mm FR4 er 4.5 / Bottom Layer 0.035mm

## Design rules (mm)
template: JLCPCB Capability(Two Layers Board)
spacing copperThickness1oz (default): track to track 0.102, other pairs 0.152 to 0.3
spacing copperThickness2oz: track to track 0.203, other pairs 0.152 to 0.3
track width copperThickness1oz (default): min 0.127, default 0.254, max 2.54
track width copperThickness2oz: min 0.203, default 0.254, max 2.54
differential pair differentialPair (default): width min 0.127, default 0.254, max 2.54; gap min 0.152, default 0.152
via viaSize (default): diameter min 0.5, default 0.61, max 10; hole min 0.3, default 0.305, max 6.3

## Placement (name value [footprint] x y rotation side)
5V|GND|AD7
红外  -  [HDR-TH_3P-P2.54-V-M]  33.98 53.17 180 top
ADC接口  -  [HDR-TH_8P-P2.54-V-M-R2-C4-S2.54]  51.51 54.95 180 top
C3  10uF  [CAP-SMD_L6.0-W3.2]  51.89 22.95 0 top
C4  22uF  [C0805]  49.1 18.5 90 top
C5  330uF  [CAP-SMD_BD8.0-L8.3-W8.3-LS9.3-FD-1]  58.49 44.92 90 top
C6  100nF  [C0805]  63.09 33.39 90 top
C8  100nF  [C0805]  56.83 29.74 0 top
C9  2.2nF  [C0805]  50.45 38.77 0 top
C10  22pF  [C0603]  51.75 35.15 90 top
C12  100nF  [C0805]  73.62 41.89 0 top
C14  100nF  [C0805]  30.4 39.96 90 top
C16  100nF  [C0805]  23.1 36.93 0 top
C17  2.2nF  [C0805]  17.76 44.93 0 top
C18  22pF  [C0603]  18.83 41.36 90 top
C20  100nF  [C0805]  4.52 40.73 180 top
C21  100nF  [C0805]  31.93 15.41 90 top
C23  100nF  [C0805]  24.09 12.83 0 top
C24  2.2nF  [C0805]  18.27 21.05 0 top
C25  22pF  [C0603]  19.57 17.68 90 top
C27  100nF  [C0805]  8.96 18.5 180 top
C28  10nF  [C0805]  28.65 45.94 180 top
C29  10nF  [C0805]  31.57 20.41 270 top
C30  10nF  [C0805]  61.47 38.86 180 top
C31  470uF  [CAP-SMD_BD8.0-L8.3-W8.3-LS8.9-FD]  73.48 34.63 0 top
C32  470uF  [CAP-SMD_BD8.0-L8.3-W8.3-LS8.9-FD]  5.92 34.89 180 top
C33  470uF  [CAP-SMD_BD8.0-L8.3-W8.3-LS8.9-FD]  6.42 12.66 180 top
D5  1N5819WS  [SOD-323_L1.8-W1.3-LS2.5-RD]  57.02 27.58 0 top
D7  BZX84C4V7  [SOT-23-3_L2.9-W1.3-P1.90-LS2.4-BR]  65.99 48.22 180 top
D8  1N5819WS  [SOD-323_L1.8-W1.3-LS2.5-RD]  23.21 34.7 0 top
D10  1N5819WS  [SOD-323_L1.8-W1.3-LS2.5-RD]  24.33 9.99 0 top
GND
5V  -  [HDR-TH_8P-P2.54-V-M-R2-C4-S2.54]  63.45 54.95 0 top
H3  PZ254V-11-03P  [HDR-TH_3P-P2.54-V-M]  73.62 56.29 0 top
H12  PZ254V-11-05P  [HDR-TH_5P-P2.54-V-M]  26.5 56.3 180 top
H13  PZ254V-11-05P  [HDR-TH_5P-P2.54-V-M]  39.2 56.3 180 top
H19  X6521WV-2x15H-C60D30  [HDR-TH_30P-P2.54-V-M-R2-C15-S2.54-BL]  39.2 4 0 top
L1  4.7uH  [IND-SMD_L7.3-W6.6_MHCI06030]  49.35 29.42 180 top
L2  4.7uH  [IND-SMD_L7.3-W6.6_MHCI06030]  16.2 34.89 180 top
L3  4.7uH  [IND-SMD_L7.3-W6.6_MHCI06030]  17.22 11.14 180 top
LED2  XL-2012SURC  [LED0805-R-RD]  52.02 18.5 90 top
LED5  XL-2012SURC  [LED0805-R-RD]  2.74 45.55 0 top
R11  200kΩ  [R0603]  65.72 34.92 270 top
R12  100kΩ  [R0805]  65.71 38.58 270 top
R14  10kΩ  [R0805]  46.55 36.16 270 top
R15  5kΩ  [RES-ADJ-TH_3P-L6.8-W4.6-P2.50-TL-BS-3266X]  49.48 43.14 270 top
R16  3.3kΩ  [R0805]  39.75 30.15 270 top
R17  2.7kΩ  [R0603]  69.54 48.22 0 top
R18  200kΩ  [R0603]  32.48 41.68 270 top
R19  100kΩ  [R0805]  32.5 45.39 270 top
R21  10kΩ  [R0805]  13.46 41.61 90 top
R25  1kΩ  [R0603]  4.72 43.24 180 top
R26  1kΩ  [R0603]  37.28 50.89 0 top
R27  200kΩ  [R0603]  34.27 16.72 270 top
R28  100kΩ  [R0805]  34.15 20.45 270 top
R34  5kΩ  [RES-ADJ-TH_3P-L6.8-W4.6-P2.50-TL-BS-3266X]  26.49 24.6 90 top
R35  1kΩ  [R0603]  10.74 22.69 270 top
R36  13kΩ  [R0805]  13.41 5.29 90 top
R37  13kΩ  [R0805]  11.02 5.31 90 top
R38  13kΩ  [R0805]  8.34 5.31 90 top
R39  13kΩ  [R0805]  5.78 5.31 90 top
R41  12kΩ  [R0805]  18.2 24.09 180 top
R42  37.4kΩ  [R0603]  49.35 35.27 90 top
R43  37.4kΩ  [R0603]  17.23 17.84 90 top
R44  37.4kΩ  [R0603]  16.71 41.49 270 top
R45  5kΩ  [RES-ADJ-TH_3P-L6.8-W4.6-P2.50-TL-BS-3266X]  12.14 47.84 180 top
SDA1|SCL1|GND|3.3V
IIC陀螺仪  -  [HDR-TH_4P-P2.54-V-M]  14.04 56.22 0 top
SW1  RS601HL-1010011BB  [SW-TH_RS601HL-1010011BB]  73.35 21.55 270 top
TX|RX|GND
串口U0  -  [HDR-TH_3P-P2.54-V-M]  23.95 52.99 180 top
U14  A1117-3.3  [asm1117]  42.49 19.77 0 top
U16  TPS54331D  [SOIC-8_L4.9-W3.9-P1.27-LS6.0-BL]  57.6 35.14 90 top
U17  TPS54331D  [SOIC-8_L4.9-W3.9-P1.27-LS6.0-BL]  24.86 41.55 90 top
U18  TPS54331D  [SOIC-8_L4.9-W3.9-P1.27-LS6.0-BL]  25.74 17.3 90 top
U19  430Ω  [R0805]  55.95 18.63 90 top
电机控制接口  -  [HDR-TH_6P-P2.54-V-M]  9.73 1.87 0 top
电机电源指示灯  -  [LED0805-R-RD]  10.71 27.05 90 top
电机驱动板供电  -  [CONN-TH_WJ15EDGVC-3.81-2P]  4.77 24.47 270 top
电源  -  [CONN-TH_XT60]  70.81 6.56 180 top
编码器A  -  [HDR-TH_6P-P2.54-V-M-R2-C3-S2.54]  36.65 9.49 0 top
编码器B  -  [HDR-TH_6P-P2.54-V-M-R2-C3-S2.54]  46.94 9.49 0 top
舵机  -  [HDR-TH_3P-P2.54-V-M]  73.61 51.21 0 top
舵机电源指示灯  -  [LED0805-R-RD]  39.74 34.54 270 top
负压驱动  -  [HDR-TH_3P-P2.54-V-M]  73.62 53.75 0 top

## Footprints (pads in the part's own frame, mm; a bottom-side part is the same pattern mirrored in y, then rotated)
asm1117
  rect 2.5x1.1 smd: 1(2.97,-2.3) 2(2.97,0) 3(2.97,2.3)
  rect 2.34x3.6 smd: 2(-2.97,0)
C0603
  rect 0.8x0.9 smd: 1(-0.7,0) 2(0.7,0)
C0805
  rect 1.41x1.35 smd: 1(-1,0) 2(1,0)
CAP-SMD_BD8.0-L8.3-W8.3-LS8.9-FD
  rect 4x1.6 smd: 1(-3.5,0) 2(3.5,0)
CAP-SMD_BD8.0-L8.3-W8.3-LS9.3-FD-1
  rect 4x1.6 smd: 1(-3.5,0) 2(3.5,0)
CAP-SMD_L6.0-W3.2
  rect 2.208x2.376 smd: 1(-2.962,0) 2(2.962,0)
CONN-TH_WJ15EDGVC-3.81-2P
  round 2.2 hole 1.25: 1(-1.905,0) 2(1.905,0)
CONN-TH_XT60
  round 5.8 hole 4.4: 1(-3.6,0) 2(3.6,0)
HDR-TH_3P-P2.54-V-M
  rect 1.7x1.7 hole 1.1: 1(-2.54,0)
  round 1.7 hole 1.1: 2(0,0) 3(2.54,0)
HDR-TH_4P-P2.54-V-M
  rect 1.7x1.7 hole 1.1: 1(-3.81,0)
  round 1.7 hole 1.1: 2(-1.27,0) 3(1.27,0) 4(3.81,0)
HDR-TH_5P-P2.54-V-M
  rect 1.7x1.7 hole 1.1: 1(-5.08,0)
  round 1.7 hole 1.1: 2(-2.54,0) 3(0,0) 4(2.54,0) 5(5.08,0)
HDR-TH_6P-P2.54-V-M
  rect 1.7x1.7 hole 1.1: 1(-6.35,0)
  round 1.7 hole 1.1: 2(-3.81,0) 3(-1.27,0) 4(1.27,0) 5(3.81,0) 6(6.35,0)
HDR-TH_6P-P2.54-V-M-R2-C3-S2.54
  rect 1.7x1.7 hole 1.1: 1(-2.54,-1.27)
  round 1.7 hole 1.1: 2(-2.54,1.27) 3(0,-1.27) 4(0,1.27) 5(2.54,-1.27) 6(2.54,1.27)
HDR-TH_8P-P2.54-V-M-R2-C4-S2.54
  rect 1.7x1.7 hole 1.1: 1(-3.81,-1.27)
  round 1.7 hole 1.1: 2(-3.81,1.27) 3(-1.27,-1.27) 4(-1.27,1.27) 5(1.27,-1.27) 6(1.27,1.27) 7(3.81,-1.27) 8(3.81,1.27)
HDR-TH_30P-P2.54-V-M-R2-C15-S2.54-BL
  rect 1.6x1.6 hole 1.05: 1(-17.78,-1.27)
  round 1.6 hole 1.05: 2(-17.78,1.27) 3(-15.24,-1.27) 4(-15.24,1.27) 5(-12.7,-1.27) 6(-12.7,1.27) 7(-10.16,-1.27) 8(-10.16,1.27) 9(-7.62,-1.27) 10(-7.62,1.27) 11(-5.08,-1.27) 12(-5.08,1.27) 13(-2.54,-1.27) 14(-2.54,1.27) 15(0,-1.27) 16(0,1.27) 17(2.54,-1.27) 18(2.54,1.27) 19(5.08,-1.27) 20(5.08,1.27) 21(7.62,-1.27) 22(7.62,1.27) 23(10.16,-1.27) 24(10.16,1.27) 25(12.7,-1.27) 26(12.7,1.27) 27(15.24,-1.27) 28(15.24,1.27) 29(17.78,-1.27) 30(17.78,1.27)
IND-SMD_L7.3-W6.6_MHCI06030
  rect 2.524x3.12 smd: 1(-3.078,0) 2(3.078,0)
LED0805-R-RD
  rect 1x1.399 smd: 1(1.05,0) 2(-1.05,0)
R0603
  rect 0.806x0.864 smd: 1(-0.753,0) 2(0.753,0)
R0805
  rect 1.133x1.377 smd: 1(-1,0) 2(1,0)
RES-ADJ-TH_3P-L6.8-W4.6-P2.50-TL-BS-3266X
  round 1.524 hole 0.762: 1(-1.25,2.5) 2(1.25,0) 3(-1.25,-2.5)
SOD-323_L1.8-W1.3-LS2.5-RD
  rect 1x0.75 smd: 1(-1.173,0) 2(1.173,0)
SOIC-8_L4.9-W3.9-P1.27-LS6.0-BL
  oval 0.588x2.045 smd: 1(-1.905,-2.772) 2(-0.635,-2.772) 3(0.635,-2.772) 4(1.905,-2.772) 5(1.905,2.772) 6(0.635,2.772) 7(-0.635,2.772) 8(-1.905,2.772)
SOT-23-3_L2.9-W1.3-P1.90-LS2.4-BR
  rect 1.25x0.7 smd: 1(1,-0.95) 2(1,0.95) 3(-1,0)
SW-TH_RS601HL-1010011BB
  oval 2x6 hole 1x5: 1(-2.5,0) 2(2.5,0)

## Nets
GND: 5V|GND|AD7
红外.2 C3.2 C4.1 C5.2 C6.1 C10.1 C12.2 C14.1 C18.1 C20.2 C21.1 C25.1 C27.2 C28.1 C29.1 C30.1 C31.2 C32.2 C33.2 D5.2 D7.1 D8.2 D10.2 GND
5V.2 GND
5V.4 GND
5V.6 GND
5V.8 H3.1 H12.4 H19.1 H19.19 H19.20 H19.29 LED5.2 R12.1 R15.2 R19.1 R28.1 R34.2 R35.2 R36.2 R37.2 R38.2 R39.2 R42.1 R43.1 R44.2 R45.2 SDA1|SCL1|GND|3.3V
IIC陀螺仪.3 TX|RX|GND
串口U0.1 U14.1 U16.7 U17.7 U18.7 U19.2 电机控制接口.1 电机驱动板供电.1 电源.1 编码器A.6 编码器B.6 舵机.1 舵机电源指示灯.2 负压驱动.1
P3V3: H12.5 H19.2
VCC3V3: C4.2 LED2.1 SDA1|SCL1|GND|3.3V
IIC陀螺仪.4 U14.2 电机控制接口.6 编码器A.5 编码器B.5
VCC5V: 5V|GND|AD7
红外.3 C3.1 C20.1 C32.1 GND
5V.1 GND
5V.3 GND
5V.5 GND
5V.7 H19.30 L2.2 R21.1 R25.1 U14.3
VCC7.2V: C27.1 C33.1 L3.2 R41.2 电机电源指示灯.1 电机驱动板供电.2
AD0: ADC接口.3 H12.2
AD1: ADC接口.5 H12.1
AD2: ADC接口.2 H13.4
AD3: ADC接口.6 H13.2
AD4: ADC接口.1 H12.3
AD5: ADC接口.7 H13.5
AD6: ADC接口.4 H13.3
AD7: ADC接口.8 H13.1 R26.2
BAT: C5.1 C6.2 C14.2 C21.2 R11.2 R18.2 R27.2 SW1.1 U16.2 U17.2 U18.2
IO64: H19.21 编码器A.4
IO65: H19.25 R36.1 电机控制接口.5
IO66: H19.27 R38.1 电机控制接口.3
IO67: H19.23 编码器B.4
IO72: H19.9 编码器B.3
IO73: H19.7 编码器A.3
IO74: H19.13 R39.1 电机控制接口.2
IO75: H19.11 R37.1 电机控制接口.4
IO88: D7.3 H19.3 R17.1
IO89: H3.3 H19.5 负压驱动.3
RX1: H19.10
SCL1: H19.15 SDA1|SCL1|GND|3.3V
IIC陀螺仪.2
SDA1: H19.17 SDA1|SCL1|GND|3.3V
IIC陀螺仪.1
TX1: H19.8
UART0RX: H19.6 TX|RX|GND
串口U0.2
UART0TX: H19.4 TX|RX|GND
串口U0.3
VADJ: C12.1 C31.1 H3.2 L1.2 R14.2 R16.2 舵机.2 负压驱动.2
VSESE: R34.1 R41.1 U18.5
$1N5106: LED2.2 U19.1
$1N8053: SW1.2 电源.2
$1N8621: R11.1 R12.2 U16.3
$1N9019: C30.2 U16.4
$1N9100: C8.2 U16.1
$1N9333: C9.2 C10.2 U16.6
$1N9888: R14.1 R15.1 U16.5
$1N10078: C8.1 D5.1 L1.1 U16.8
$1N10148: R16.1 舵机电源指示灯.1
$1N10435: R17.2 舵机.3
$1N11574: R18.1 R19.2 U17.3
$1N11589: C28.2 U17.4
$1N11592: C16.2 U17.1
$1N11595: C17.1 R44.1
$1N11601: C17.2 C18.2 U17.6
$1N11624: C16.1 D8.1 L2.1 U17.8
$1N11734: R21.2 R45.1 U17.5
$1N14138: 5V|GND|AD7
红外.1 R26.1
$1N14868: R27.1 R28.2 U18.3
$1N14871: C29.2 U18.4
$1N14872: C23.2 U18.1
$1N14873: C24.1 R43.2
$1N14875: C24.2 C25.2 U18.6
$1N14877: C23.1 D10.1 L3.1 U18.8
$1N28496: R35.1 电机电源指示灯.2
$1N31767: C9.1 R42.2
$1N44983: LED5.1 R25.2

Pads without a net: D7 2; H19 12 14 16 18 22 24 26 28; R15 3; R34 3; R45 3; 编码器A 1 2; 编码器B 1 2

## Via types
v1: diameter 0.61, hole 0.305, Top Layer to Bottom Layer, 32 vias

## Routing (per net, layer and track width the routed paths; a pad name or vN(x,y) marks a point on that pad's centre or on a via; arc(x,y) is an arc through that point)
GND: length 23.6
  Top Layer w0.254: 编码器B.6 49.48,11.26 48.56,12.18 40.99,12.18 39.82,11.01 39.44,11.01 编码器A.6 39.82,10.12 v1(42.74,10.12) ; v1(42.87,8.09) 42.87,6.68 H19.20
  Bottom Layer w0.254: v1(42.74,10.12) 42.87,9.99 v1(42.87,8.09) ; H19.20 H19.19
  vias: v1(28.52,8.09)
P3V3: length 64.7
  Top Layer w0.254: v1(27.76,4.66) 27.76,6.06 27,6.82 26.06,6.82 v1(25.09,7.78)
  Bottom Layer w0.254: v1(27.76,4.66) 27.25,4.15 22.42,4.15 21.42,5.16 H19.2 ; v1(25.09,7.78) 25.09,19.27 22.68,21.68 22.68,49.62 25.22,52.16 25.22,53.68 24.33,54.57 23.15,54.57 H12.5
VCC3V3: length 119.7
  Top Layer w0.254: v1(37.38,21.9) 37.39,21.9 U14.2 v1(39.52,15.71) ; 编码器A.5 39.19,8.6 38.44,9.34 26.38,9.34 25.76,8.72 21.66,8.72 16.33,3.39 16.33,2.12 电机控制接口.6 ; 编码器A.5 39.32,8.09 v1(41.14,8.09) ; 编码器A.5 40.32,9.34 47.4,9.34 47.64,9.1 49.22,9.1 49.48,8.85 编码器B.5 ; v1(36.01,36.03) 36.01,46.57 34.24,48.35 v1(20.83,48.35) ; SDA1|SCL1|GND|3.3V
IIC陀螺仪.4 v1(17.85,51.4)
  Top Layer w1: 52.05,19.82 51.73,19.5 C4.2 48.83,19.77 U14.2 U14.2
  Bottom Layer w0.254: v1(20.83,48.35) 20.83,48.42 v1(17.85,51.4) ; v1(37.38,21.9) 36.01,23.27 v1(36.01,36.03) ; v1(41.14,8.09) 41.14,14.08 v1(39.52,15.71)
VCC5V: length 160.6
  Top Layer w0.254: 48.05,22.07 51.62,22.07 54.43,19.27 v1(54.43,17.74) ; 5V|GND|AD7
红外.3 35.51,49.11 55.06,49.11 GND
5V.1
  Top Layer w0.5: C20.1 5.79,41 5.79,45.94 9.03,49.18 25.29,49.18 29.28,53.17 5V|GND|AD7
红外.3
  Top Layer w1: U14.3 42.1,22.07 40.97,23.2 38.81,23.2 30.43,31.58 14.24,31.58 10.94,34.89 ; R25.1 5.52,43.2 C20.1
  Top Layer w1.5: 48.05,22.07 U14.3
  Top Layer w2: GND
5V.7 GND
5V.5 GND
5V.3 GND
5V.1 ; C3.1 48.05,22.07 ; L2.2 C32.1 9.42,37.36 6.04,40.73 13.34,40.73 R21.1
  Bottom Layer w0.254: H19.30 54.43,7.82 v1(54.43,17.74)
VCC7.2V: length 35.7
  Top Layer w0.254: 电机驱动板供电.2 10.3,28.1 电机电源指示灯.1
  Top Layer w2: C27.1 10.22,18.76 11.11,18.76 16.44,24.09 R41.2 ; C27.1 9.96,19.67 6.56,23.08 5.28,23.08 ; C27.1 9.96,12.7 C33.1 12.62,12.66 L3.2
AD0: length 28.6
  Bottom Layer w0.254: ADC接口.3 52.78,55.28 51.65,54.15 51.65,52.81 50.87,52.03 47.57,52.03 45.03,54.57 30.93,54.57 29.2,56.3 H12.2
AD1: length 19.7
  Bottom Layer w0.254: H12.1 32,56.3 33.35,54.95 48.97,54.95 ADC接口.5
AD2: length 23
  Top Layer w0.254: H13.4 36.95,56.3 38.81,54.44 v1(38.81,53.05)
  Bottom Layer w0.254: ADC接口.2 52.4,50.76 46.94,50.76 44.65,53.05 v1(38.81,53.05)
AD3: length 10.9
  Top Layer w0.254: H13.2 41.87,56.43 42.32,56.43 43.15,57.26 43.15,57.27 43.31,57.43 45.48,57.43 46.57,56.33 46.57,55.75 47.23,55.09 48.39,55.09 49.68,53.81 50.11,53.81 ADC接口.6
AD4: length 38.5
  Bottom Layer w0.254: H12.3 32.93,49.87 54.05,49.87 56.97,52.79 56.97,54.57 ADC接口.1
AD5: length 14.6
  Bottom Layer w0.254: ADC接口.7 46.43,57.49 43,57.49 42.94,57.43 36.19,57.43 35.06,56.3 H13.5
AD6: length 18.2
  Top Layer w0.254: v1(40.08,53.81) 40.08,55.42 H13.3
  Bottom Layer w0.254: ADC接口.4 52.78,52.54 51.64,51.4 47.19,51.4 44.78,53.81 v1(40.08,53.81)
AD7: length 13
  Top Layer w0.254: R26.2 38.87,50.89 H13.1 45.08,56.3 ADC接口.8
BAT: length 133.1
  Top Layer w0.254: SW1.1 71.92,25.49 70.9,25.49
  Top Layer w1: U18.2 31.67,16.67 ; C21.2 33.45,16.41 34.02,15.84 34.27,15.84
  Top Layer w1.2: 70.9,25.49 70.77,25.36 39.44,25.36 32.48,32.32 R18.2 ; C6.2 65.5,34.39
  Top Layer w1.5: 73.23,24.05 72.97,24.05 62.85,13.93 36.64,13.93 34.78,15.79 34.27,15.79 ; 70.9,25.49 65.85,30.54 65.85,34.04 65.72,34.17 ; C5.1 57.35,40.28 57.35,35.52 58.37,34.5 U16.2 62.85,34.5 ; 27.63,40.92 30.36,40.92 C14.2 30.43,40.93 R18.2
IO64: length 30.4
  Top Layer w0.254: 编码器A.4 37.03,11.14 37.28,11.14 38.68,12.53 50.24,12.53 51.76,11.01 51.76,7.45 50.75,6.44 v1(50.75,6.31)
  Bottom Layer w0.254: v1(50.75,6.31) 50.75,2.25 49.98,1.49 48.07,1.49 H19.21
IO65: length 42.7
  Top Layer w0.254: R36.1 13.53,4.17 电机控制接口.5 13.53,1.36 14.47,0.43 49.6,0.43 H19.25
IO66: length 50.3
  Top Layer w0.254: 电机控制接口.3 8.45,4.19 R38.1 9.32,5.29 v1(15.31,5.29) ; v1(19.33,5.04) 20.29,4.08 53.45,4.08 54.44,3.09 H19.27
  Bottom Layer w0.254: v1(19.33,5.04) 19.07,5.29 v1(15.31,5.29)
IO67: length 9
  Bottom Layer w0.254: H19.23 48.21,3.88 48.21,9.49 编码器B.4
IO72: length 21.9
  Bottom Layer w0.254: 编码器B.3 46.94,7.84 45.67,6.56 45.67,2.37 44.08,0.78 33.53,0.78 H19.9
IO73: length 11.2
  Top Layer w0.254: v1(30.3,5.04) 30.3,6.31 30.55,6.56 35,6.56 编码器A.3
  Bottom Layer w0.254: v1(30.3,5.04) 30.3,3.99 H19.7
IO74: length 38.3
  Top Layer w0.254: v1(15.31,7.33) 15.19,7.45 7.83,7.45 7.06,6.68 7.06,5.59 R39.1 5.92,4.18 电机控制接口.2
  Bottom Layer w0.254: v1(15.31,7.33) 15.55,7.09 33.97,7.09 35.51,5.55 35.51,3.88 H19.13
IO75: length 31
  Top Layer w0.254: v1(15.19,3.14) 17.85,5.8 v1(17.85,6.44) ; v1(12.14,3.14) 12.14,3.2 R37.1 11.02,1.89 电机控制接口.4
  Bottom Layer w0.254: H19.11 33.77,3.08 33.02,3.08 32.84,3.26 32.84,6.06 32.46,6.44 v1(17.85,6.44) ; v1(15.19,3.14) v1(12.14,3.14)
IO88: length 84.3
  Top Layer w0.254: R17.1 D7.3 67,48.2 v1(67,46.7) ; v1(43.02,1.43) 42.56,0.98 24.71,0.98 23.96,1.73 H19.3
  Bottom Layer w0.254: v1(67,46.7) 67,46.57 66.49,46.06 66.49,32.66 52.97,19.14 51.25,19.14 50.11,18 50.11,16.98 49.6,16.47 43.89,16.47 42.86,15.44 42.86,11.7 41.96,10.8 41.96,8.62 41.98,8.6 41.98,6.95 42.95,5.98 42.95,1.51 v1(43.02,1.43)
IO89: length 109.6
  Top Layer w0.254: H3.3 负压驱动.3 76.16,52.79 77.27,51.68 77.27,50.99 79.57,48.69 79.57,3.3 77.38,1.1 v1(52.27,1.1)
  Bottom Layer w0.254: v1(52.27,1.1) 51.59,0.43 28.8,0.43 H19.5
SCL1: length 79.7
  Top Layer w0.254: v1(24.33,29.04) v1(20.14,29.04)
  Bottom Layer w0.254: H19.15 39.2,3.74 37.92,5.03 37.92,17.36 26.23,29.04 v1(24.33,29.04) ; 12.77,56.22 12.39,56.6 11.95,56.6 11.2,57.35 7.63,57.35 7.38,57.1 7.38,37.29 15.45,29.22 19.96,29.22 v1(20.14,29.04)
SDA1: length 73.7
  Top Layer w0.254: v1(24.33,29.93) v1(20.14,29.93)
  Bottom Layer w0.254: v1(20.14,29.93) 17.09,29.93 8.45,38.57 8.45,54.44 SDA1|SCL1|GND|3.3V
IIC陀螺仪.1 ; H19.17 41.74,3.25 40.46,4.53 40.46,12.79 38.55,14.69 38.55,18.25 26.87,29.93 v1(24.33,29.93)
UART0RX: length 50.3
  Top Layer w0.254: v1(24.08,7.78) 24.08,7.69 H19.6
  Bottom Layer w0.254: v1(24.08,7.78) 24.08,7.82 22.55,9.34 22.55,20.92 22.06,21.41 22.06,50.97 23.95,52.86 TX|RX|GND
串口U0.2
UART0TX: length 48.8
  Top Layer w0.254: v1(22.17,7.78) 23.96,6 H19.4
  Bottom Layer w0.254: v1(22.17,7.78) 21.41,8.55 TX|RX|GND
串口U0.3
VADJ: length 88.2
  Top Layer w1: L1.2 46,29.15 R16.2 ; R14.2 46.55,29.71
  Top Layer w2: 46.17,29.68 42.49,33.36 42.49,43.52 46.3,47.33 53.41,47.33 55.83,44.92 65.22,44.92 69.98,40.16 C31.1 72.62,37.28 C12.1 72.77,42.03 72.77,45.98 73.61,46.82 舵机.2 73.62,51.23 负压驱动.2 H3.2
VSESE: length 9.7
  Top Layer w0.254: R34.1 23.99,20.23 U18.5
  Top Layer w1: R41.1 23.25,24.09 R34.1
$1N5106: length 4.6
  Top Layer w0.254: U19.1 55.05,16.72 53.03,16.72 52.3,17.45 LED2.2
$1N8053: length 15
  Top Layer w2: 电源.2 67.21,12.91 SW1.2
$1N8621: length 7.3
  Top Layer w0.254: U16.3 65.62,35.78 R11.1 65.72,37.57 R12.2
$1N9019: length 1.9
  Top Layer w1: U16.4 60.47,37.14 C30.2
$1N9100: length 4.5
  Top Layer w0.254: U16.1 60.38,32.29 C8.2
$1N9333: length 6.1
  Top Layer w0.254: U16.6 51.95,35.78 51.45,36.28 C9.2
$1N9888: length 19.7
  Top Layer w0.254: R15.1 54.83,41.54 54.83,37.79 ; 54.83,37.79 52.46,40.16 48.4,40.16 46.55,38.31 R14.1 ; 54.83,37.79 U16.5
$1N10078: length 9.5
  Top Layer w1: 52.55,29.3 55.39,29.3 C8.1 ; C8.1 54.83,30.74 U16.8 ; C8.1 55.83,27.6 D5.1
$1N10148: length 2
  Top Layer w0.254: R16.1 39.69,31.21 39.69,33.08
$1N10435: length 7.1
  Top Layer w0.254: R17.2 v1(71.7,48.22)
  Bottom Layer w0.254: v1(71.7,48.22) 73.16,48.22 舵机.3
$1N11574: length 6.9
  Top Layer w0.254: R19.2 32.5,42.45 R18.1 32.24,42.19 27.63,42.19
$1N11589: length 2.5
  Top Layer w1: 27.63,43.46 27.63,45.92 C28.2
$1N11592: length 4.7
  Top Layer w0.254: C16.2 24.91,36.93 27.63,39.65
$1N11595: length 2.7
  Top Layer w0.254: C17.1 16.71,44.88 R44.1
$1N11601: length 6.2
  Top Layer w0.254: C17.2 18.83,44.86 C18.2 21.96,42.06 U17.6
$1N11624: length 8.2
  Top Layer w1: 22.1,39.63 U17.8
  Top Layer w1.5: 22.1,39.63 C16.1 22.1,34.76 22.04,34.7 19.47,34.7 19.03,35.14
$1N11734: length 13.8
  Top Layer w0.254: R21.2 13.46,45.27 R45.1 14.49,46.44 20.27,46.44 22.09,44.62 U17.5
$1N14138: length 2.3
  Top Layer w0.254: R26.1 36.52,50.9 5V|GND|AD7
红外.1
$1N14868: length 8.2
  Top Layer w0.254: R28.2 34.27,19.34 34.27,17.35 33.62,18 28.57,18 U18.3
$1N14871: length 3.1
  Top Layer w1: 31.46,19.52 31.15,19.21 U18.4
$1N14872: length 4.5
  Top Layer w0.254: U18.1 25.94,12.83 C23.2
$1N14873: length 2.5
  Top Layer w0.254: 17.21,18.55 17.27,18.61 C24.1
$1N14875: length 6.4
  Top Layer w0.254: U18.6 20.02,17.94 C25.2 19.57,20.74 C24.2
$1N14877: length 8.6
  Top Layer w1: L3.1 22.01,11.14 23.09,10.06 C23.1 22.97,12.95 U18.8
$1N28496: length 2.6
  Top Layer w0.254: 10.87,23.45 10.71,23.61 电机电源指示灯.2
$1N31767: length 2.8
  Top Layer w0.254: C9.1 49.45,36.12 R42.2
$1N44983: length 1.8
  Top Layer w0.254: 3.92,45.05 3.92,43.29 R25.2

## Copper pours and planes (outline as drawn; the poured copper is in the pictures)
GND on Top Layer: -4.63,66 86.18,66 86.18,-3.72 -4.63,-3.72
GND on Bottom Layer: -3.99,66 84.91,66 84.91,-4.23 -3.99,-4.23

Small or netless copper shapes (teardrops, artwork), in the pictures only: 171 on Top Layer, 58 on Bottom Layer

## Text on the board
Top Layer: 2025 / 重庆大学 / 智能车小队
Top Silkscreen Layer: NC|IO64|GND / NC|IO73|3.3V | NC|IO67|GND / NC|IO72|3.3V | IO88 | IO89
